# Altium schematic sheet DM1098LUXD-LITE_Project_Information.SchDoc: =project_title
size Tabloid; CompanyName: Luxonis Holding; Organization: Luxonis Holding; Address1: 1925 Harmony Park Drive; Address2: Westminster, CO; Address3: 80234; Address4: United States; SheetNumber: 1; SheetTotal: 9
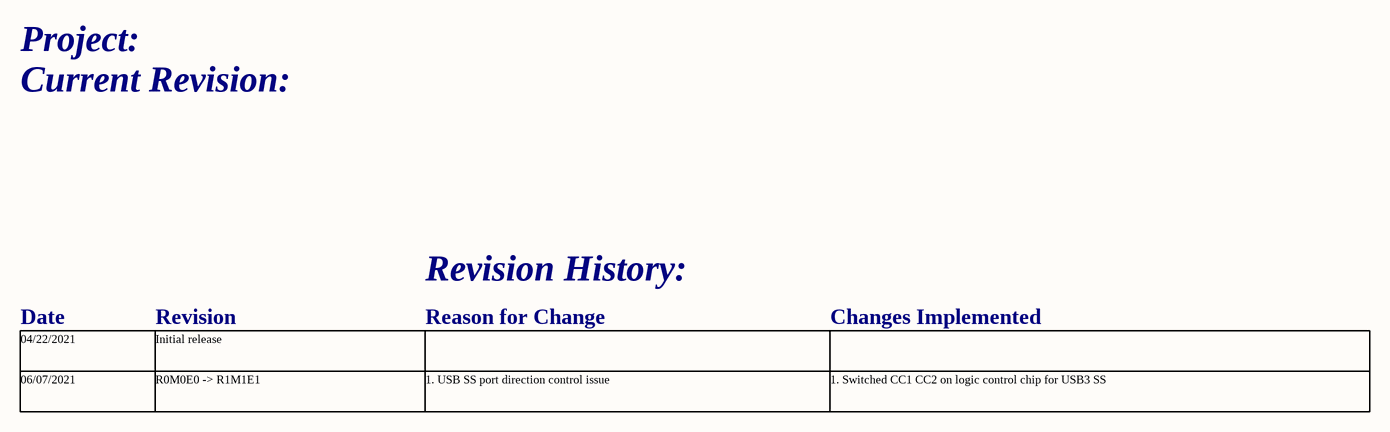
[diagram p0: DM1098LUXD-LITE_Project_Information.SchDoc]

## Notes on the sheet
- Project:
- Current Revision:
- Revision History:
- 04/22/2021
- Date
- Initial release
- Revision
- Reason for Change
- Changes Implemented
- 06/07/2021
- R0M0E0 -> R1M1E1
- 1. USB SS port direction control issue
- 1. Switched CC1 CC2 on logic control chip for USB3 SS
- Title
- Size:
- Date:
- Tabloid
- Number:
- Time:
- Revision:
- Sheet
- of
- Drawn by: